# Altium schematic sheet GSB-S07-V00-SPImicrofit.SchDoc
size A4
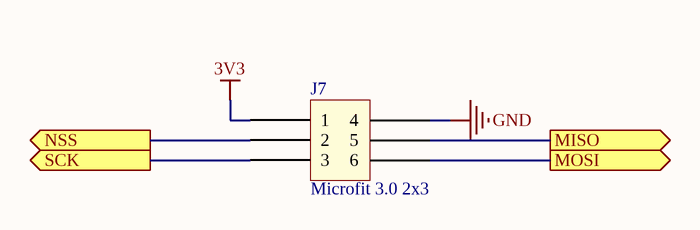
[diagram p0: GSB-S07-V00-SPImicrofit.SchDoc]

## Parts
J7  Microfit 3.0 2x3  [Microfit_2X3_R_TH]

## Ports
MISO (out), MOSI (out), NSS (out), SCK (out)

## Nets
3V3: J7.1
GND: J7.4
MISO: J7.5 ; port MISO
MOSI: J7.6 ; port MOSI
NSS: J7.2 ; port NSS
SCK: J7.3 ; port SCK

## Library data of the parts
J7 = Microfit_2x3